# Altium project PCB-Relay-Board-V1.PrjPcb (part 3 of 3)

## Sheet X7A15T-Fabric.SchDoc: PCB-Relay-Board X7A15T-Fabric
size A3; Organization: Test Engineering; Address1: Hans-Bunte-Strasse 19; Address2: D-79108 Freiburg; Address3: Germany; DocumentNumber: U33111; Revision: V1.0; SheetNumber: 4; SheetTotal: 7; Date: JUN 2020; CheckedBy: Moerz, Hoeren; Author: Rudziński; CompanyName: TDK-Micronas GmbH; DrawnBy: Rudziński; Engineer: Rudziński; DateDraw: JUN 2020; DateChecked: 2020-06-19; PageSetup: Record=PageOptions|CenterHorizontal=True|CenterVertical=True|PrintScale=0.97|XCorrection=1.00|YCorrection=1.00|PrintKind=0|BorderSize=5000000|LeftOffset=0|BottomOffset=0|Orientation=2|PaperLength=1000|PaperWidth=1000|Scale=100|PaperSource=7|PrintQuality=-3|MediaType=1|DitherType=10|PrintScaleMode=1|PaperKind=A4|PaperIndex=9; TitleTyp: Title-Typ; Block: CPU & SCT8; Workspace: Workspace
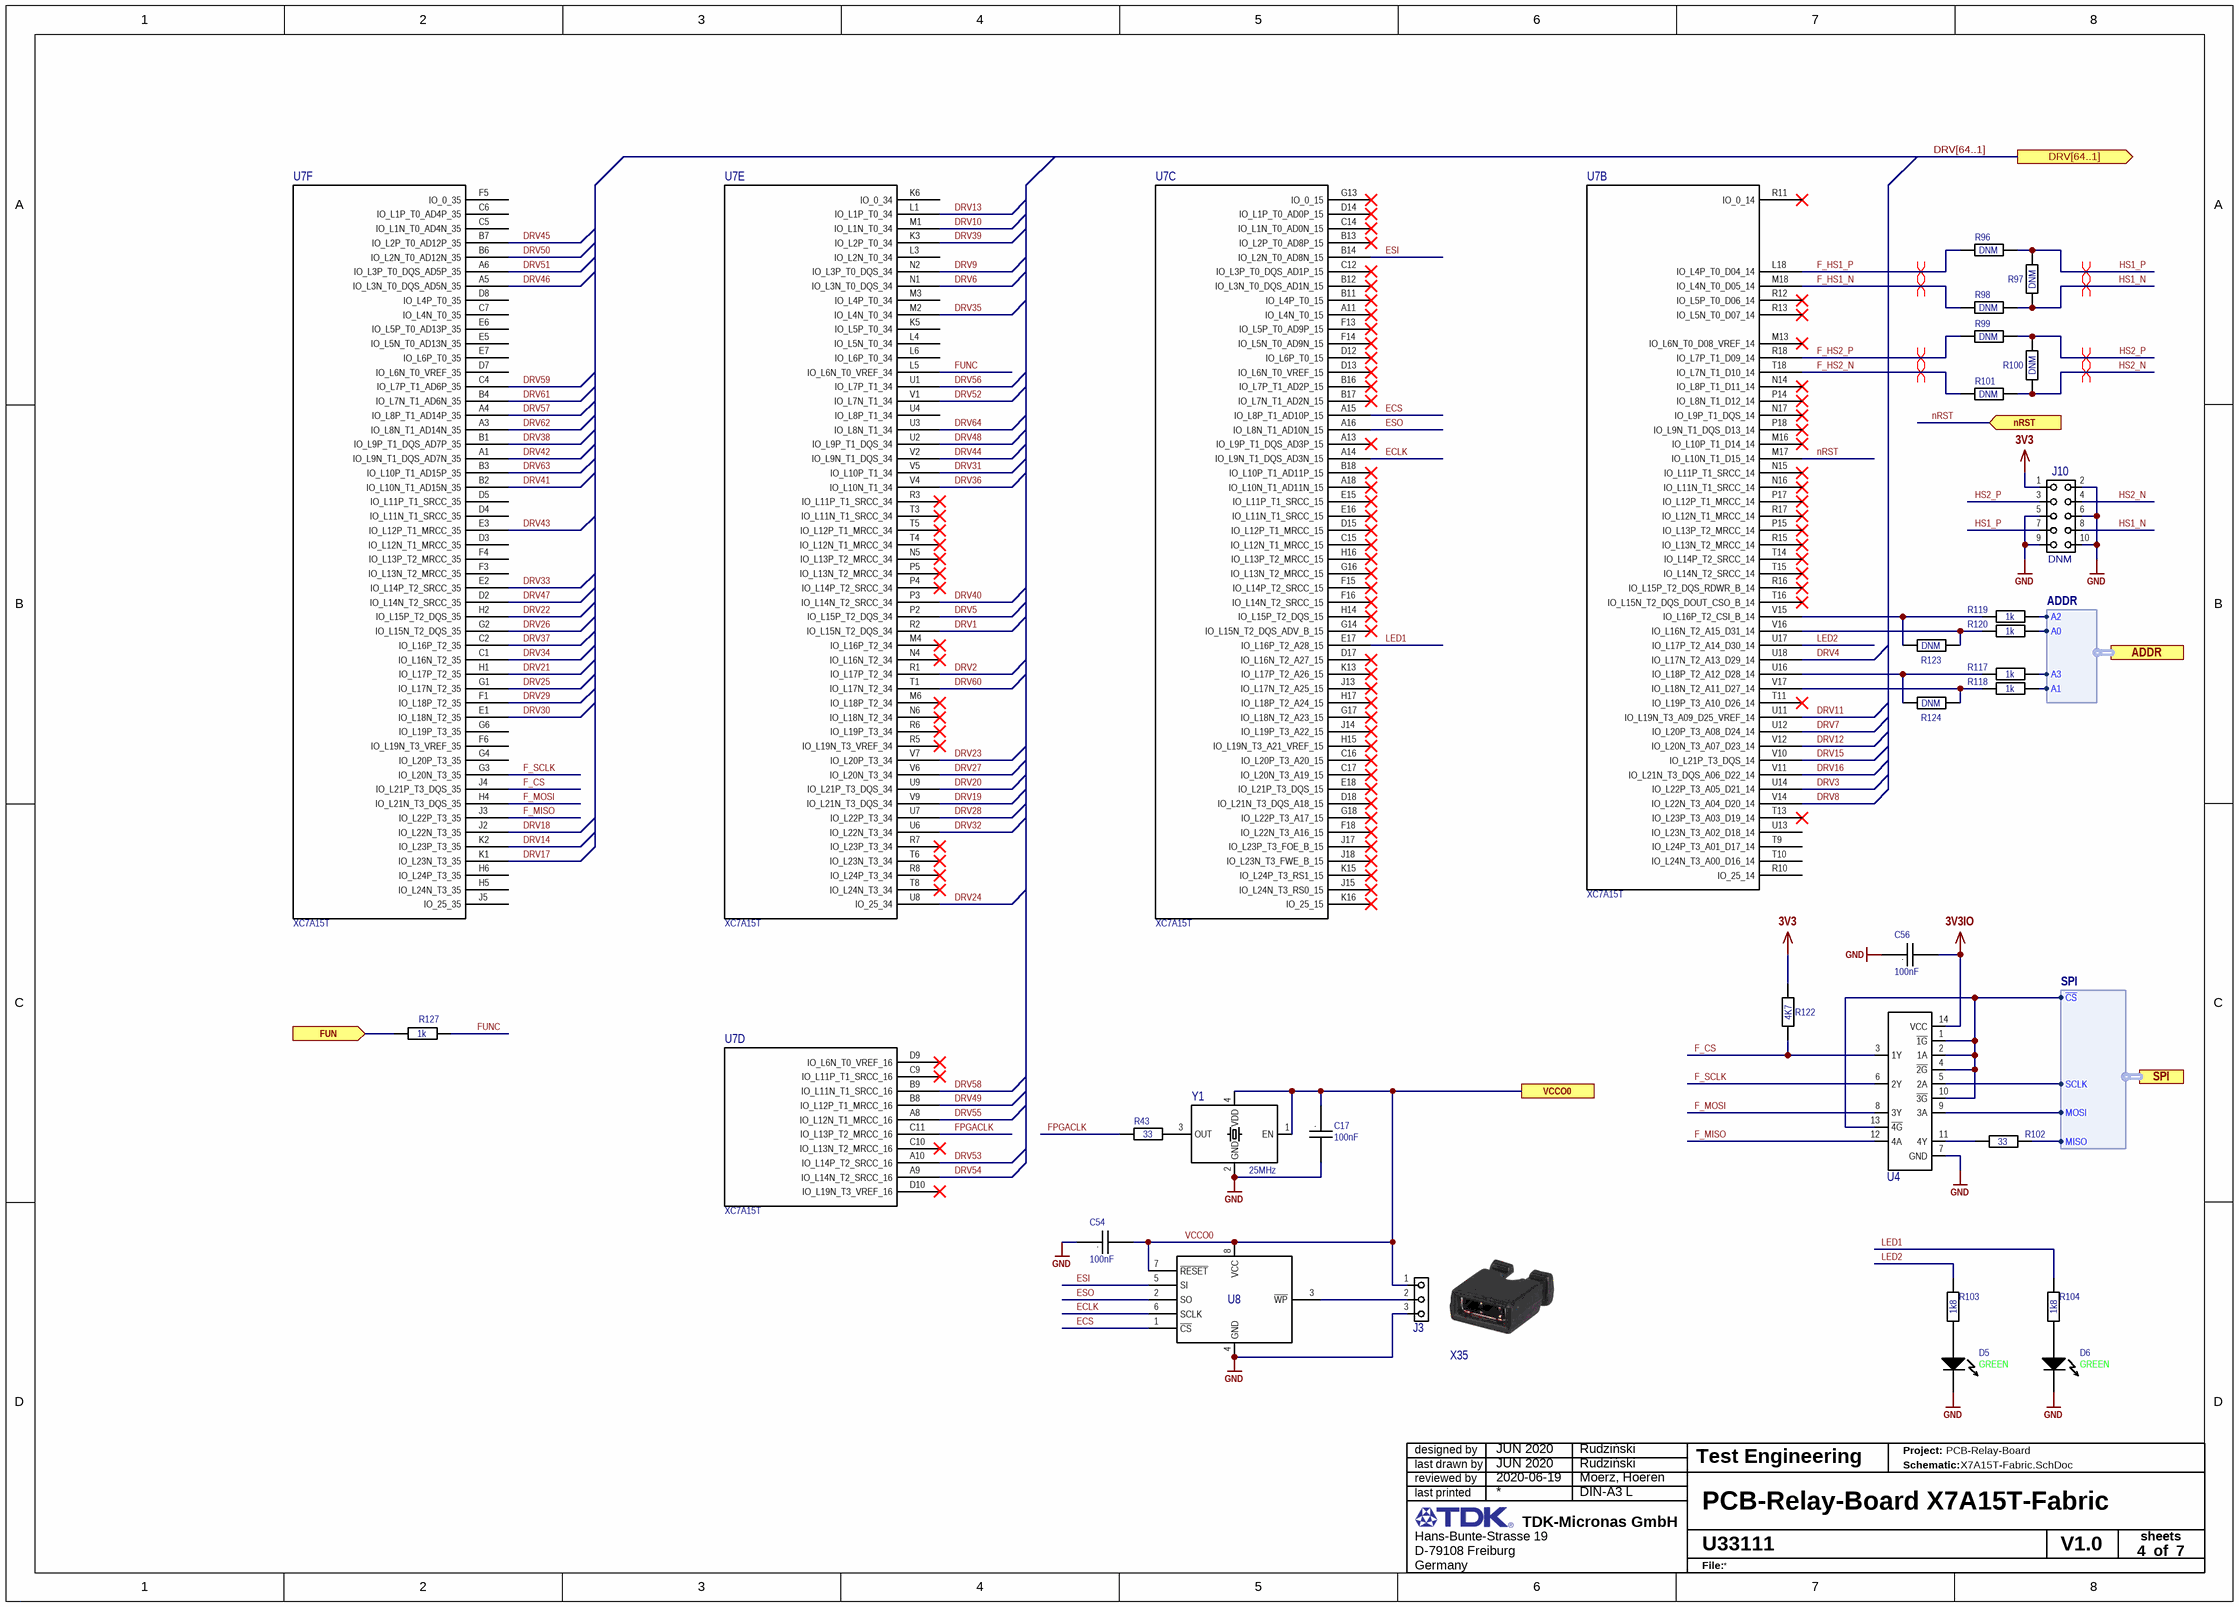
[diagram p4: X7A15T-Fabric.SchDoc]

### Parts
C17  value 100nF  [C0402 Reflow]  (hidden comment: C)
C54  value 100nF  [C0402 Reflow]  (hidden comment: C)
C56  value 100nF  [C0402 Reflow]  (hidden comment: C)
D5  Color: GREEN  [L0603G]  (hidden comment: D)
D6  Color: GREEN  [L0603G]  (hidden comment: D)
J3  J  [Header 100mil 3x1]  (value not drawn)
J10  NicName: DNM  [Header 100mil 5x2]  (hidden comment: J)  (no BOM)
R43  value 33  [R0402 Reflow]  (hidden comment: R)
R96  value DNM  [R0402 Reflow]  (hidden comment: R)  (no BOM)
R97  value DNM  [R0402 Reflow]  (hidden comment: R)  (no BOM)
R98  value DNM  [R0402 Reflow]  (hidden comment: R)  (no BOM)
R99  value DNM  [R0402 Reflow]  (hidden comment: R)  (no BOM)
R100  value DNM  [R0402 Reflow]  (hidden comment: R)  (no BOM)
R101  value DNM  [R0402 Reflow]  (hidden comment: R)  (no BOM)
R102  value 33  [R0402 Reflow]  (hidden comment: R)
R103  value 1k8  [R0603 Reflow]  (hidden comment: R)
R104  value 1k8  [R0603 Reflow]  (hidden comment: R)
R117  value 1k  [R0402 Reflow]  (hidden comment: R)
R118  value 1k  [R0402 Reflow]  (hidden comment: R)
R119  value 1k  [R0402 Reflow]  (hidden comment: R)
R120  value 1k  [R0402 Reflow]  (hidden comment: R)
R122  value 4K7  [R0402 Reflow]  (hidden comment: R)
R123  value DNM  [R0402 Reflow]  (hidden comment: R)  (no BOM)
R124  value DNM  [R0402 Reflow]  (hidden comment: R)  (no BOM)
R127  value 1k  [R0402 Reflow]  (hidden comment: R)
U4  U  [TSSOP14]  (value not drawn)
U7  NicName: XC7A15T  [XC7A15T-1CSG324C]  (hidden comment: U)  (parts B,C,D,E,F of 8)
U8  U  [SOIC8 (R-8)]  (value not drawn)
X35  X  (value not drawn)
Y1  Frequency: 25MHz  [4SMD]  (hidden comment: Y)

### Ports
ADDR (harness ADDR), DRV[64..1] (out), FUN (in), nRST (in), SPI (harness SPI), VCCO0

### Harnesses
SPI: MISO, MOSI, SCLK, ~{CS}
ADDR: A3, A2, A1, A0

### Nets
3V3: C17.1 C54.2 J3.1 J10.1 R122.2 U8.7(~{RESET}) U8.8(VCC) Y1.1(EN) Y1.4(VDD) ; port VCCO0  [also labelled VCCO0]
3V3IO: C56.2 U4.14(VCC)
GND: C17.2 C54.1 C56.1 D5.2(Cathode) D6.2(Cathode) J3.3 J10.2 J10.5 J10.6 J10.9 J10.10 U4.7(GND) U8.4(GND) Y1.2(GND)
~{CS}: U4.1(~{1G}) U4.2(1A) U4.4(~{2G}) U4.10(~{3G}) U4.13(~{4G}) ; port SPI.~{CS}
A0: R120.2 ; port ADDR.A0
A1: R118.2 ; port ADDR.A1
A2: R119.2 ; port ADDR.A2
A3: R117.2 ; port ADDR.A3
DRV1: U7.R2(IO_L15N_T2_DQS_34)
DRV2: U7.R1(IO_L17P_T2_34)
DRV3: U7.U14(IO_L22P_T3_A05_D21_14)
DRV4: U7.U18(IO_L17N_T2_A13_D29_14)
DRV5: U7.P2(IO_L15P_T2_DQS_34)
DRV6: U7.N1(IO_L3N_T0_DQS_34)
DRV7: U7.U12(IO_L20P_T3_A08_D24_14)
DRV8: U7.V14(IO_L22N_T3_A04_D20_14)
DRV9: U7.N2(IO_L3P_T0_DQS_34)
DRV10: U7.M1(IO_L1N_T0_34)
DRV11: U7.U11(IO_L19N_T3_A09_D25_VREF_14)
DRV12: U7.V12(IO_L20N_T3_A07_D23_14)
DRV13: U7.L1(IO_L1P_T0_34)
DRV14: U7.K2(IO_L23P_T3_35)
DRV15: U7.V10(IO_L21P_T3_DQS_14)
DRV16: U7.V11(IO_L21N_T3_DQS_A06_D22_14)
DRV17: U7.K1(IO_L23N_T3_35)
DRV18: U7.J2(IO_L22N_T3_35)
DRV19: U7.V9(IO_L21N_T3_DQS_34)
DRV20: U7.U9(IO_L21P_T3_DQS_34)
DRV21: U7.H1(IO_L17P_T2_35)
DRV22: U7.H2(IO_L15P_T2_DQS_35)
DRV23: U7.V7(IO_L20P_T3_34)
DRV24: U7.U8(IO_25_34)
DRV25: U7.G1(IO_L17N_T2_35)
DRV26: U7.G2(IO_L15N_T2_DQS_35)
DRV27: U7.V6(IO_L20N_T3_34)
DRV28: U7.U7(IO_L22P_T3_34)
DRV29: U7.F1(IO_L18P_T2_35)
DRV30: U7.E1(IO_L18N_T2_35)
DRV31: U7.V5(IO_L10P_T1_34)
DRV32: U7.U6(IO_L22N_T3_34)
DRV33: U7.E2(IO_L14P_T2_SRCC_35)
DRV34: U7.C1(IO_L16N_T2_35)
DRV35: U7.M2(IO_L4N_T0_34)
DRV36: U7.V4(IO_L10N_T1_34)
DRV37: U7.C2(IO_L16P_T2_35)
DRV38: U7.B1(IO_L9P_T1_DQS_AD7P_35)
DRV39: U7.K3(IO_L2P_T0_34)
DRV40: U7.P3(IO_L14N_T2_SRCC_34)
DRV41: U7.B2(IO_L10N_T1_AD15N_35)
DRV42: U7.A1(IO_L9N_T1_DQS_AD7N_35)
DRV43: U7.E3(IO_L12P_T1_MRCC_35)
DRV44: U7.V2(IO_L9N_T1_DQS_34)
DRV45: U7.B7(IO_L2P_T0_AD12P_35)
DRV46: U7.A5(IO_L3N_T0_DQS_AD5N_35)
DRV47: U7.D2(IO_L14N_T2_SRCC_35)
DRV48: U7.U2(IO_L9P_T1_DQS_34)
DRV49: U7.B8(IO_L12P_T1_MRCC_16)
DRV50: U7.B6(IO_L2N_T0_AD12N_35)
DRV51: U7.A6(IO_L3P_T0_DQS_AD5P_35)
DRV52: U7.V1(IO_L7N_T1_34)
DRV53: U7.A10(IO_L14P_T2_SRCC_16)
DRV54: U7.A9(IO_L14N_T2_SRCC_16)
DRV55: U7.A8(IO_L12N_T1_MRCC_16)
DRV56: U7.U1(IO_L7P_T1_34)
DRV57: U7.A4(IO_L8P_T1_AD14P_35)
DRV58: U7.B9(IO_L11N_T1_SRCC_16)
DRV59: U7.C4(IO_L7P_T1_AD6P_35)
DRV60: U7.T1(IO_L17N_T2_34)
DRV61: U7.B4(IO_L7N_T1_AD6N_35)
DRV62: U7.A3(IO_L8N_T1_AD14N_35)
DRV63: U7.B3(IO_L10P_T1_AD15P_35)
DRV64: U7.U3(IO_L8N_T1_34)
ECLK: U7.A14(IO_L9N_T1_DQS_AD3N_15) U8.6(SCLK)  [project net ECLK_4]
ECS: U7.A15(IO_L8P_T1_AD10P_15) U8.1(~{CS})  [project net ECS_4]
ESI: U7.B14(IO_L2N_T0_AD8N_15) U8.5(SI)  [project net ESI_4]
ESO: U7.A16(IO_L8N_T1_AD10N_15) U8.2(SO)  [project net ESO_4]
F_CS: R122.1 U4.3(1Y) U7.J4(IO_L21P_T3_DQS_35)  [project net F_CS_4]
F_HS1_N: R98.1 U7.M18(IO_L4N_T0_D05_14)  [project net F_HS1_N_4]
F_HS1_P: R96.1 U7.L18(IO_L4P_T0_D04_14)  [project net F_HS1_P_4]
F_HS2_N: R101.1 U7.T18(IO_L7N_T1_D10_14)  [project net F_HS2_N_4]
F_HS2_P: R99.1 U7.R18(IO_L7P_T1_D09_14)  [project net F_HS2_P_4]
F_MISO: U4.12(4A) U7.J3(IO_L22P_T3_35)  [project net F_MISO_4]
F_MOSI: U4.8(3Y) U7.H4(IO_L21N_T3_DQS_35)  [project net F_MOSI_4]
F_SCLK: U4.6(2Y) U7.G3(IO_L20N_T3_35)  [project net F_SCLK_4]
FPGACLK: R43.2 U7.C11(IO_L13P_T2_MRCC_16)  [project net FPGACLK_4]
FUN: R127.1 ; port FUN
FUNC: R127.2 U7.L5(IO_L6N_T0_VREF_34)  [project net FUNC_4]
HS1_N: J10.8 R97.1 R98.2  [project net HS1_N_4]
HS1_P: J10.7 R96.2 R97.2  [project net HS1_P_4]
HS2_N: J10.4 R100.1 R101.2  [project net HS2_N_4]
HS2_P: J10.3 R99.2 R100.2  [project net HS2_P_4]
LED1: R104.2 U7.E17(IO_L16P_T2_A28_15)  [project net LED1_4]
LED2: R103.2 U7.U17(IO_L17P_T2_A14_D30_14)  [project net LED2_4]
MISO: R102.1 ; port SPI.MISO
MOSI: U4.9(3A) ; port SPI.MOSI
nRST: U7.M17(IO_L10N_T1_D15_14) ; port nRST
SCLK: U4.5(2A) ; port SPI.SCLK
NetD5_1: D5.1(Anode) R103.1
NetD6_1: D6.1(Anode) R104.1
NetJ3_2: J3.2 U8.3(~{WP})
NetR43_1: R43.1 Y1.3(OUT)
NetR102_2: R102.2 U4.11(4Y)
NetR117_1: R117.1 R124.1 U7.U16(IO_L18P_T2_A12_D28_14)
NetR118_1: R118.1 R124.2 U7.V17(IO_L18N_T2_A11_D27_14)
NetR119_1: R119.1 R123.1 U7.V15(IO_L16P_T2_CSI_B_14)
NetR120_1: R120.1 R123.2 U7.V16(IO_L16N_T2_A15_D31_14)

Not connected (* = marked no-connect by the designer): U7 A11(IO_L4N_T0_15)* A13(IO_L9P_T1_DQS_AD3P_15)* A18(IO_L10N_T1_AD11N_15)* B11(IO_L4P_T0_15)* B12(IO_L3N_T0_DQS_AD1N_15)* B13(IO_L2P_T0_AD8P_15)* B16(IO_L7P_T1_AD2P_15)* B17(IO_L7N_T1_AD2N_15)* B18(IO_L10P_T1_AD11P_15)* C5(IO_L1N_T0_AD4N_35) C6(IO_L1P_T0_AD4P_35) C7(IO_L4N_T0_35) C9(IO_L11P_T1_SRCC_16)* C10(IO_L13N_T2_MRCC_16)* C12(IO_L3P_T0_DQS_AD1P_15)* C14(IO_L1N_T0_AD0N_15)* C15(IO_L12N_T1_MRCC_15)* C16(IO_L20P_T3_A20_15)* C17(IO_L20N_T3_A19_15)* D3(IO_L12N_T1_MRCC_35) D4(IO_L11N_T1_SRCC_35) D5(IO_L11P_T1_SRCC_35) D7(IO_L6N_T0_VREF_35) D8(IO_L4P_T0_35) D9(IO_L6N_T0_VREF_16)* D10(IO_L19N_T3_VREF_16)* D12(IO_L6P_T0_15)* D13(IO_L6N_T0_VREF_15)* D14(IO_L1P_T0_AD0P_15)* D15(IO_L12P_T1_MRCC_15)* D17(IO_L16N_T2_A27_15)* D18(IO_L21N_T3_DQS_A18_15)* E5(IO_L5N_T0_AD13N_35) E6(IO_L5P_T0_AD13P_35) E7(IO_L6P_T0_35) E15(IO_L11P_T1_SRCC_15)* E16(IO_L11N_T1_SRCC_15)* E18(IO_L21P_T3_DQS_15)* F3(IO_L13N_T2_MRCC_35) F4(IO_L13P_T2_MRCC_35) F5(IO_0_35) F6(IO_L19N_T3_VREF_35) F13(IO_L5P_T0_AD9P_15)* F14(IO_L5N_T0_AD9N_15)* F15(IO_L14P_T2_SRCC_15)* F16(IO_L14N_T2_SRCC_15)* F18(IO_L22N_T3_A16_15)* G4(IO_L20P_T3_35) G6(IO_L19P_T3_35) G13(IO_0_15)* G14(IO_L15N_T2_DQS_ADV_B_15)* G16(IO_L13N_T2_MRCC_15)* G17(IO_L18N_T2_A23_15)* G18(IO_L22P_T3_A17_15)* H5(IO_L24N_T3_35) H6(IO_L24P_T3_35) H14(IO_L15P_T2_DQS_15)* H15(IO_L19N_T3_A21_VREF_15)* H16(IO_L13P_T2_MRCC_15)* H17(IO_L18P_T2_A24_15)* J5(IO_25_35) J13(IO_L17N_T2_A25_15)* J14(IO_L19P_T3_A22_15)* J15(IO_L24N_T3_RS0_15)* J17(IO_L23P_T3_FOE_B_15)* J18(IO_L23N_T3_FWE_B_15)* K5(IO_L5P_T0_34) K6(IO_0_34) K13(IO_L17P_T2_A26_15)* K15(IO_L24P_T3_RS1_15)* K16(IO_25_15)* L3(IO_L2N_T0_34) L4(IO_L5N_T0_34) L6(IO_L6P_T0_34) M3(IO_L4P_T0_34) M4(IO_L16P_T2_34)* M6(IO_L18P_T2_34)* M13(IO_L6N_T0_D08_VREF_14)* M16(IO_L10P_T1_D14_14)* N4(IO_L16N_T2_34)* N5(IO_L13P_T2_MRCC_34)* N6(IO_L18N_T2_34)* N14(IO_L8P_T1_D11_14)* N15(IO_L11P_T1_SRCC_14)* N16(IO_L11N_T1_SRCC_14)* N17(IO_L9P_T1_DQS_14)* P4(IO_L14P_T2_SRCC_34)* P5(IO_L13N_T2_MRCC_34)* P14(IO_L8N_T1_D12_14)* P15(IO_L13P_T2_MRCC_14)* P17(IO_L12P_T1_MRCC_14)* P18(IO_L9N_T1_DQS_D13_14)* R3(IO_L11P_T1_SRCC_34)* R5(IO_L19N_T3_VREF_34)* R6(IO_L19P_T3_34)* R7(IO_L23P_T3_34)* R8(IO_L24P_T3_34)* R10(IO_25_14) R11(IO_0_14)* R12(IO_L5P_T0_D06_14)* R13(IO_L5N_T0_D07_14)* R15(IO_L13N_T2_MRCC_14)* R16(IO_L15P_T2_DQS_RDWR_B_14)* R17(IO_L12N_T1_MRCC_14)* T3(IO_L11N_T1_SRCC_34)* T4(IO_L12N_T1_MRCC_34)* T5(IO_L12P_T1_MRCC_34)* T6(IO_L23N_T3_34)* T8(IO_L24N_T3_34)* T9(IO_L24P_T3_A01_D17_14) T10(IO_L24N_T3_A00_D16_14) T11(IO_L19P_T3_A10_D26_14)* T13(IO_L23P_T3_A03_D19_14)* T14(IO_L14P_T2_SRCC_14)* T15(IO_L14N_T2_SRCC_14)* T16(IO_L15N_T2_DQS_DOUT_CSO_B_14)* U4(IO_L8P_T1_34) U13(IO_L23N_T3_A02_D18_14)

### Buses and harness runs
bus DRV[64..1] = port DRV[64..1]

### Layout directives
differential pair; net class GENHS_DP: F_HS1_N_4, F_HS1_P_4, F_HS2_N_4, F_HS2_P_4, HS1_N_4, HS1_P_4, HS2_N_4, HS2_P_4

### Notes on the sheet
- designed by
- reviewed by
- last drawn by
- Project:
- Schematic:
- last printed
- DIN-A3 L
- sheets
- of
- File:
- (in symbol C) .

### Library data of the parts
C17 C54 C56 = C: CAP CER 0.1UF 25V X7R 0402; 04. Manufacturer: Yageo; 07. Manufacturer  Part Number: CC0402KRX7R8BB104; Tolerance: ±5%; Voltage Rating: 16V; 03. Unit Price: 0.09; 13. Created Date/Name: AUG2018/Hören; Type: X7R; ComponentLink1Description: Info; ComponentLink1URL: https://www.digikey.de/product-detail/en/kemet/C0402C104J4RACTU/399-7761-6-ND/3472292; 02. Distributor Part Number: 311-2077-6-ND; 09. Operating Temperature: -55°C ~ 125°C; 11. RoHS: YES; 01. Distributor: DigiKey; ComponentLink2Description: DataSheet; ComponentLink2URL: https://content.kemet.com/datasheets/KEM_C1002_X7R_SMD.pdf; Package: 0402
D5 D6 = LED: LED GREEN DIFFUSED 0603 SMD; 04. Manufacturer: OSRAM Opto Semiconductors Inc.; 07. Manufacturer  Part Number: LG L29K-G2J1-24-Z; Vf: 1.7V; If: 2mA; Wave Length: 570nm; Viewing Angle: 160°; 03. Unit Price: 0.4; 13. Created Date/Name: AUG2018/Hören; ComponentLink1Description: Info; ComponentLink1URL: https://www.digikey.de/products/en?keywords=475-2709-6-ND; ComponentLink2Description: DataSheet; ComponentLink2URL: https://www.digikey.de/products/en?keywords=475-2709-6-ND; 02. Distributor Part Number: 475-2709-6-ND; 11. RoHS: YES; 01. Distributor: DigiKey
J3 = Header 3Pins 100mil: CONN HEADER VERT 3POS 2.54MM; 04. Manufacturer: Samtec Inc.; 07. Manufacturer  Part Number: HMTSW-103-07-G-S-240; 03. Unit Price: 0.25; 13. Created Date/Name: AUG2018/Hören; 01. Distributor: Samtec Inc.; 02. Distributor Part Number: HMTSW-103-07-G-S-240; 11. RoHS: YES; ComponentLink1Description: Info; ComponentLink1URL: https://www.samtec.com/products/hmtsw-103-07-g-s-240; ComponentLink2Description: DataSheet; ComponentLink2URL: http://suddendocs.samtec.com/catalog_english/hmtsw.pdf
J10 = Header 5x2Pins 100mil: 04. Manufacturer: Samtec Inc.; 07. Manufacturer  Part Number: HMTSW-103-07-G-S-240; 03. Unit Price: 0.25; 13. Created Date/Name: AUG2018/Hören; 01. Distributor: Samtec Inc.; 02. Distributor Part Number: HMTSW-103-07-G-S-240; 11. RoHS: YES; ComponentLink1Description: Info; ComponentLink1URL: https://www.samtec.com/products/hmtsw-103-07-g-s-240; ComponentLink2Description: DataSheet; ComponentLink2URL: http://suddendocs.samtec.com/catalog_english/hmtsw.pdf
R43 R102 = R: RES SMD 33 OHM 1% 1/16W 0402; 04. Manufacturer: Yageo; 07. Manufacturer  Part Number: RC0402FR-0733RL; 03. Unit Price: 0.09; 13. Created Date/Name: AUG2018/Hören; Power Rating: 63mW; Tolerance: ±1%; ComponentLink1URL: https://www.digikey.de/products/en?keywords=311-33.0LRDKR-ND; ComponentLink1Description: Info; 02. Distributor Part Number: 311-33.0LRDKR-ND; 09. Operating Temperature: -55°C ~ 155°C; 11. RoHS: YES; 01. Distributor: DigiKey; ComponentLink2Description: DataSheet; Type: Thick Film; Package: 0402
R96-R101 = R_19: RES SMD 33 OHM 1% 1/16W 0402; 04. Manufacturer: Yageo; 07. Manufacturer  Part Number: RC0402FR-0733RL; 03. Unit Price: 0.09; 13. Created Date/Name: AUG2018/Hören; Power Rating: 63mW; Tolerance: ±1%; ComponentLink1URL: https://www.digikey.de/products/en?keywords=311-33.0LRDKR-ND; ComponentLink1Description: Info; 02. Distributor Part Number: 311-33.0LRDKR-ND; 09. Operating Temperature: -55°C ~ 155°C; 11. RoHS: YES; 01. Distributor: DigiKey; ComponentLink2Description: DataSheet; Type: Thick Film; Package: 0402
R103 R104 = R: RES SMD 1.8K OHM 1% 1/16W 0402; 04. Manufacturer: Yageo; 07. Manufacturer  Part Number: RC0402FR-071K8L; 03. Unit Price: 0.09; 13. Created Date/Name: AUG2018/Hören; Power Rating: 63mW; Tolerance: ±1%; ComponentLink1URL: https://www.digikey.de/product-detail/en/yageo/RC0402FR-071K65L/YAG3043DKR-ND/5282914; ComponentLink1Description: Info; 02. Distributor Part Number: 311-1.80KLRCT-ND; 09. Operating Temperature: -55°C ~ 155°C; 11. RoHS: YES; 01. Distributor: DigiKey; ComponentLink2Description: DataSheet; Type: Thick Film; Package: 0402
R117-R120 R127 = R: RES SMD 1K OHM 1% 1/16W 0402; 04. Manufacturer: Yageo; 07. Manufacturer  Part Number: RC0402FR-071KP; 03. Unit Price: 0.09; 13. Created Date/Name: AUG2018/Hören; Tolerance: ±1%; ComponentLink1URL: *; ComponentLink1Description: Info; 02. Distributor Part Number: YAG1254CT-ND; 09. Operating Temperature: -xx..+yy°C; 11. RoHS: ???; 01. Distributor: DigiKey; ComponentLink2Description: DataSheet; Package: *
R122-R124 = R: RES SMD 4.7K OHM 1% 1/16W 0402; 04. Manufacturer: Yageo; 07. Manufacturer  Part Number: RC0402FR-074K7L; 03. Unit Price: 0.09; 13. Created Date/Name: AUG2018/Hören; Power Rating: 63mW; Tolerance: ±1%; ComponentLink1URL: https://www.digikey.de/products/en?keywords=311-4.7KLRDKR-ND; ComponentLink1Description: Info; 02. Distributor Part Number: 311-4.7KLRDKR-ND; 09. Operating Temperature: -55°C ~ 155°C; 11. RoHS: YES; 01. Distributor: DigiKey; ComponentLink2Description: DataSheet; Type: Thick Film; Package: 0402
U4 = 74LCX125: IC BUF NON-INVERT 3.6V 14TSSOP; 04. Manufacturer: STMicroelectronics; 07. Manufacturer  Part Number: 74LCX125YTTR; 03. Unit Price: 0.51; 01. Distributor: DigiKey; 02. Distributor Part Number: 497-13204-2-ND; 11. RoHS: YES; ComponentLink1Description: Info; ComponentLink2Description: DataSheet; Package: TSSOP14
U7 = XC7A15T-CS324: XC7A15T-1CSG324C; MFR: XILINX; POPULATED: yes; 03. Unit Price: 20.65; MFR-PN: XC7A15T-CS324; 04. Manufacturer: XILINX; 07. Manufacturer  Part Number: XC7A15T-1CSG324C; 01. Distributor: Avnet; 02. Distributor Part Number: XC7A15T-1CSG324C; 09. Operating Temperature: 0°C ~ 85°C (TJ); 11. RoHS: YES; ComponentLink4Description: Info; ComponentLink4URL: https://www.digikey.de/products/en?keywords=XC7A15T-1CSG324C; ComponentLink5Description: DataSheet; ComponentLink5URL: https://www.xilinx.com/support/documentation/data_sheets/ds181_Artix_7_Data_Sheet.pdf; ComponentLink6Description: NXP; ComponentLink6URL: https://www.nxp.com/part/MK20DN512VMD10
U8 = MX25R3235FM1IH0: IC FLASH 32M SPI 80MHZ 8SOP; 04. Manufacturer: Macronix; 03. Unit Price: 0.79; 13. Created Date/Name: AUG 2018 / Hören; 01. Distributor: DigiKey; 02. Distributor Part Number: 1092-1175-ND; 07. Manufacturer  Part Number: MX25R3235FM1IH0; ComponentLink1Description: Info; ComponentLink1URL: https://www.digikey.de/product-detail/en/macronix/MX25R3235FM1IH0/1092-1175-ND/5957736; ComponentLink2Description: DataSheet; ComponentLink2URL: https://www.macronix.com/Lists/Datasheet/Attachments/7534/MX25R3235F%2c%20Wide%20Range%2c%2032Mb%2c%20v1.6.pdf
X35 = Jumper: CONN JUMPER SHORTING .100" GOLD; 04. Manufacturer: Sullins Connector Solutions; 07. Manufacturer  Part Number: QPC02SXGN-RC; 03. Unit Price: 0.09; 13. Created Date/Name: AUG2018/Hören; 01. Distributor: DigiKey; 02. Distributor Part Number: S9337-ND; 09. Operating Temperature: -xx..+yy°C; 11. RoHS: ???; ComponentLink1Description: Info; ComponentLink1URL: https://www.digikey.de/product-detail/en/sullins-connector-solutions/QPC02SXGN-RC/S9337-ND/2618262; ComponentLink2Description: DataSheet
Y1 = ASE-25.000MHZ-LC-T: XTAL OSC XO 25.0000MHZ CMOS SMD; 04. Manufacturer: Abracon LLC; 03. Unit Price: 1.46; 13. Created Date/Name: AUG 2018 / Hören; 01. Distributor: DigiKey; 02. Distributor Part Number: 535-9568-1-ND; 07. Manufacturer  Part Number: ASE-25.000MHZ-LC-T; 11. RoHS: YES; ComponentLink1Description: Info; ComponentLink1URL: https://www.digikey.de/products/en?keywords=535-9568-1-ND; ComponentLink2Description: DataSheet; Package: 4SMD

## Sheet X7A15T-Power.SchDoc: PCB-Relay-Board X7A15T-Power
size A4 portrait; Organization: Test Engineering; Address1: Hans-Bunte-Strasse 19; Address2: D-79108 Freiburg; Address3: Germany; DocumentNumber: U33111; Revision: V1.0; SheetNumber: 5; SheetTotal: 7; Date: JUN 2020; CheckedBy: Moerz, Hoeren; Author: Rudziński; CompanyName: TDK-Micronas GmbH; DrawnBy: Rudziński; Engineer: Rudziński; DateDraw: JUN 2020; DateChecked: 2020-06-19; PageSetup: Record=PageOptions|CenterHorizontal=True|CenterVertical=True|PrintScale=0.97|XCorrection=1.00|YCorrection=1.00|PrintKind=0|BorderSize=5000000|LeftOffset=0|BottomOffset=0|Orientation=2|PaperLength=1000|PaperWidth=1000|Scale=100|PaperSource=7|PrintQuality=-3|MediaType=1|DitherType=10|PrintScaleMode=1|PaperKind=A4|PaperIndex=9; TitleTyp: Title-Typ; Block: CPU & SCT8; Workspace: Workspace
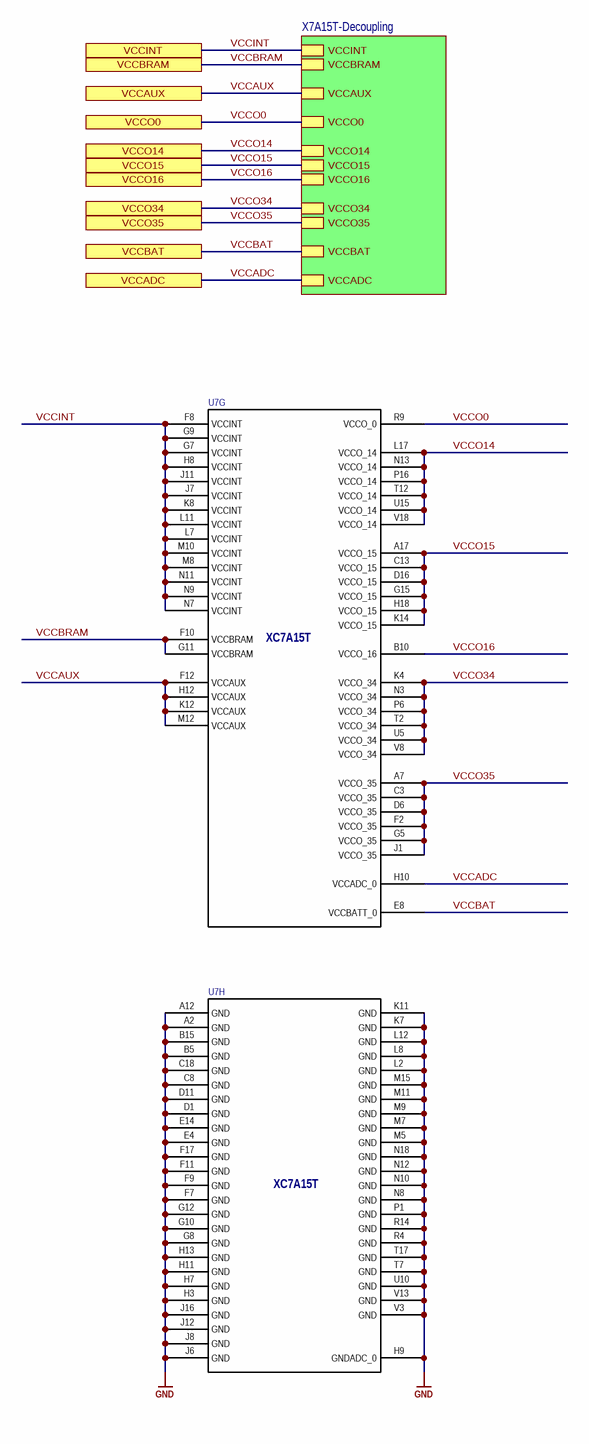
[diagram p5: X7A15T-Power.SchDoc]

### Parts
U7  NicName: XC7A15T  [XC7A15T-1CSG324C]  (hidden comment: U)  (parts G,H of 8)

### Sub-sheets
X7A15T-Decoupling = X7A15T-Decoupling.SchDoc: VCCBRAM, VCCAUX, VCCINT, VCCO34, VCCBAT, VCCO14, VCCO15, VCCO0, VCCADC, VCCO16, VCCO35

### Ports
VCCADC, VCCAUX, VCCBAT, VCCBRAM, VCCINT, VCCO0, VCCO14, VCCO15, VCCO16, VCCO34, VCCO35

### Nets
GND: U7.A2(GND) U7.A12(GND) U7.B5(GND) U7.B15(GND) U7.C8(GND) U7.C18(GND) U7.D1(GND) U7.D11(GND) U7.E4(GND) U7.E8(VCCBATT_0) U7.E14(GND) U7.F7(GND) U7.F9(GND) U7.F11(GND) U7.F17(GND) U7.G8(GND) U7.G10(GND) U7.G12(GND) U7.H3(GND) U7.H7(GND) U7.H9(GNDADC_0) U7.H11(GND) U7.H13(GND) U7.J6(GND) U7.J8(GND) U7.J12(GND) U7.J16(GND) U7.K7(GND) U7.K11(GND) U7.L2(GND) U7.L8(GND) U7.L12(GND) U7.M5(GND) U7.M7(GND) U7.M9(GND) U7.M11(GND) U7.M15(GND) U7.N8(GND) U7.N10(GND) U7.N12(GND) U7.N18(GND) U7.P1(GND) U7.R4(GND) U7.R14(GND) U7.T7(GND) U7.T17(GND) U7.U10(GND) U7.V3(GND) U7.V13(GND) ; port VCCBAT, sheet X7A15T-Decoupling/VCCBAT  [also labelled VCCBAT]
VCCADC: U7.H10(VCCADC_0) ; port VCCADC, sheet X7A15T-Decoupling/VCCADC  [project net 1V8A]
VCCAUX: U7.F12(VCCAUX) U7.H12(VCCAUX) U7.K12(VCCAUX) U7.M12(VCCAUX) ; port VCCAUX, sheet X7A15T-Decoupling/VCCAUX  [project net 1V8]
VCCBRAM: U7.F8(VCCINT) U7.F10(VCCBRAM) U7.G7(VCCINT) U7.G9(VCCINT) U7.G11(VCCBRAM) U7.H8(VCCINT) U7.J7(VCCINT) U7.J11(VCCINT) U7.K8(VCCINT) U7.L7(VCCINT) U7.L11(VCCINT) U7.M8(VCCINT) U7.M10(VCCINT) U7.N7(VCCINT) U7.N9(VCCINT) U7.N11(VCCINT) ; port VCCINT, port VCCBRAM, sheet X7A15T-Decoupling/VCCBRAM, sheet X7A15T-Decoupling/VCCINT  [also labelled VCCINT]  [project net 1V0]
VCCO0: U7.A7(VCCO_35) U7.A17(VCCO_15) U7.B10(VCCO_16) U7.C3(VCCO_35) U7.C13(VCCO_15) U7.D6(VCCO_35) U7.D16(VCCO_15) U7.F2(VCCO_35) U7.G5(VCCO_35) U7.G15(VCCO_15) U7.H18(VCCO_15) U7.J1(VCCO_35) U7.K4(VCCO_34) U7.K14(VCCO_15) U7.L17(VCCO_14) U7.N3(VCCO_34) U7.N13(VCCO_14) U7.P6(VCCO_34) U7.P16(VCCO_14) U7.R9(VCCO_0) U7.T2(VCCO_34) U7.T12(VCCO_14) U7.U5(VCCO_34) U7.U15(VCCO_14) U7.V8(VCCO_34) U7.V18(VCCO_14) ; port VCCO0, port VCCO14, port VCCO15, port VCCO16, port VCCO34, port VCCO35, sheet X7A15T-Decoupling/VCCO34, sheet X7A15T-Decoupling/VCCO14, sheet X7A15T-Decoupling/VCCO15, sheet X7A15T-Decoupling/VCCO0, sheet X7A15T-Decoupling/VCCO16, sheet X7A15T-Decoupling/VCCO35  [also labelled VCCO14, VCCO15, VCCO16, VCCO34, VCCO35]  [project net 3V3]

### Notes on the sheet
- designed by
- reviewed by
- last drawn by
- Project:
- Schematic:
- last printed
- DIN-A4 P
- sheets
- of
- File:

### Library data of the parts
U7 = XC7A15T-CS324: as U7 on sheet X7A15T-Fabric; MFR-PN: XC7A15T-CS324; 04. Manufacturer: XILINX; 07. Manufacturer  Part Number: XC7A15T-1CSG324C; 01. Distributor: Avnet; 02. Distributor Part Number: XC7A15T-1CSG324C; 09. Operating Temperature: 0°C ~ 85°C (TJ); 11. RoHS: YES; ComponentLink4Description: Info; ComponentLink4URL: https://www.digikey.de/products/en?keywords=XC7A15T-1CSG324C; ComponentLink5Description: DataSheet; ComponentLink5URL: https://www.xilinx.com/support/documentation/data_sheets/ds181_Artix_7_Data_Sheet.pdf; ComponentLink6Description: NXP; ComponentLink6URL: https://www.nxp.com/part/MK20DN512VMD10

## Sheet X7A15T-Decoupling.SchDoc: PCB-Relay-Board X7A15T-Decoupling
size A4 portrait; Organization: Test Engineering; Address1: Hans-Bunte-Strasse 19; Address2: D-79108 Freiburg; Address3: Germany; DocumentNumber: U33111; Revision: V1.0; SheetNumber: 6; SheetTotal: 7; Date: JUN 2020; CheckedBy: Moerz, Hoeren; Author: Rudziński; CompanyName: TDK-Micronas GmbH; DrawnBy: Rudziński; Engineer: Rudziński; DateDraw: JUN 2020; DateChecked: 2020-06-19; PageSetup: Record=PageOptions|CenterHorizontal=True|CenterVertical=True|PrintScale=0.97|XCorrection=1.00|YCorrection=1.00|PrintKind=0|BorderSize=5000000|LeftOffset=0|BottomOffset=0|Orientation=2|PaperLength=1000|PaperWidth=1000|Scale=100|PaperSource=7|PrintQuality=-3|MediaType=1|DitherType=10|PrintScaleMode=1|PaperKind=A4|PaperIndex=9; TitleTyp: Title-Typ; Block: CPU & SCT8; Workspace: Workspace
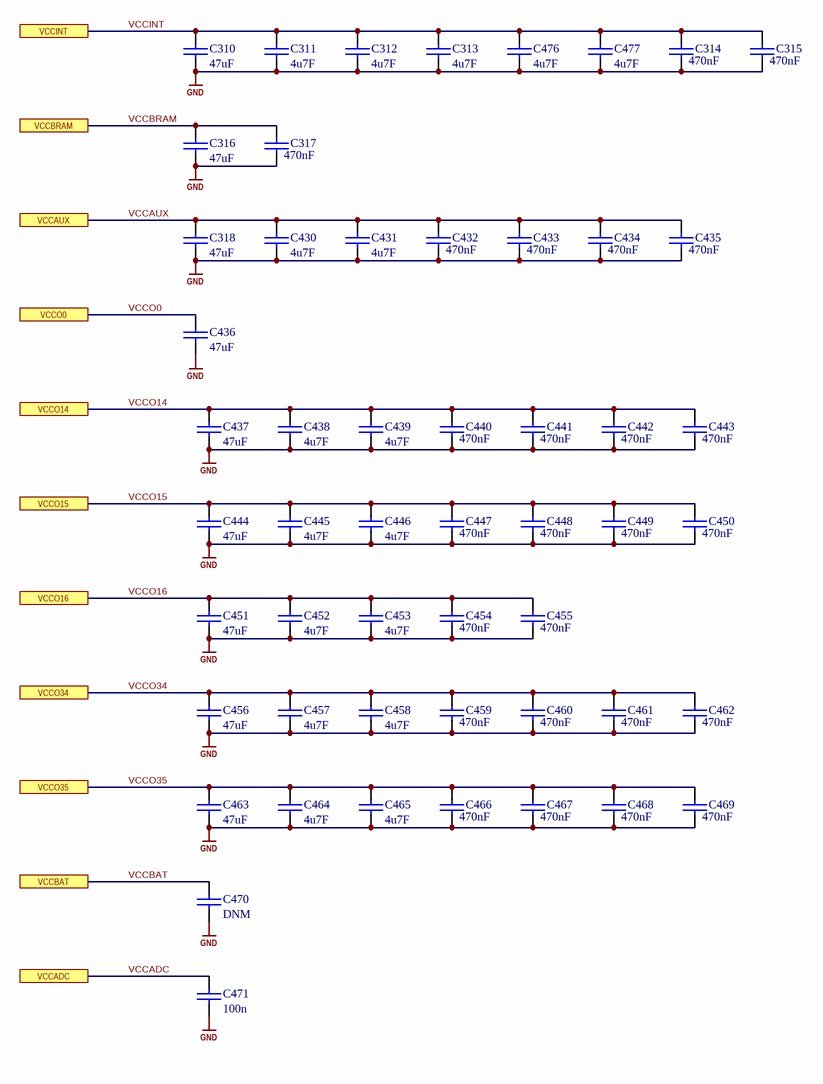
[diagram p6: X7A15T-Decoupling.SchDoc]

### Parts
C310  value 47uF  [C0805 Reflow]  (hidden comment: C)
C311  value 4u7F  [C0402 RevOne]  (hidden comment: C)
C312  value 4u7F  [C0402 RevOne]  (hidden comment: C)
C313  value 4u7F  [C0402 RevOne]  (hidden comment: C)
C314  value 470nF  [C0402 RevOne]  (hidden comment: C)
C315  value 470nF  [C0402 RevOne]  (hidden comment: C)
C316  value 47uF  [C0805 Reflow]  (hidden comment: C)
C317  value 470nF  [C0402 RevOne]  (hidden comment: C)
C318  value 47uF  [C0805 Reflow]  (hidden comment: C)
C430  value 4u7F  [C0402 RevOne]  (hidden comment: C)
C431  value 4u7F  [C0402 RevOne]  (hidden comment: C)
C432  value 470nF  [C0402 RevOne]  (hidden comment: C)
C433  value 470nF  [C0402 RevOne]  (hidden comment: C)
C434  value 470nF  [C0402 RevOne]  (hidden comment: C)
C435  value 470nF  [C0402 RevOne]  (hidden comment: C)
C436  value 47uF  [C0805 Reflow]  (hidden comment: C)
C437  value 47uF  [C0805 Reflow]  (hidden comment: C)
C438  value 4u7F  [C0402 RevOne]  (hidden comment: C)
C439  value 4u7F  [C0402 RevOne]  (hidden comment: C)
C440  value 470nF  [C0402 RevOne]  (hidden comment: C)
C441  value 470nF  [C0402 RevOne]  (hidden comment: C)
C442  value 470nF  [C0402 RevOne]  (hidden comment: C)
C443  value 470nF  [C0402 RevOne]  (hidden comment: C)
C444  value 47uF  [C0805 Reflow]  (hidden comment: C)
C445  value 4u7F  [C0402 RevOne]  (hidden comment: C)
C446  value 4u7F  [C0402 RevOne]  (hidden comment: C)
C447  value 470nF  [C0402 RevOne]  (hidden comment: C)
C448  value 470nF  [C0402 RevOne]  (hidden comment: C)
C449  value 470nF  [C0402 RevOne]  (hidden comment: C)
C450  value 470nF  [C0402 RevOne]  (hidden comment: C)
C451  value 47uF  [C0805 Reflow]  (hidden comment: C)
C452  value 4u7F  [C0402 RevOne]  (hidden comment: C)
C453  value 4u7F  [C0402 RevOne]  (hidden comment: C)
C454  value 470nF  [C0402 RevOne]  (hidden comment: C)
C455  value 470nF  [C0402 RevOne]  (hidden comment: C)
C456  value 47uF  [C0805 Reflow]  (hidden comment: C)
C457  value 4u7F  [C0402 RevOne]  (hidden comment: C)
C458  value 4u7F  [C0402 RevOne]  (hidden comment: C)
C459  value 470nF  [C0402 RevOne]  (hidden comment: C)
C460  value 470nF  [C0402 RevOne]  (hidden comment: C)
C461  value 470nF  [C0402 RevOne]  (hidden comment: C)
C462  value 470nF  [C0402 RevOne]  (hidden comment: C)
C463  value 47uF  [C0805 Reflow]  (hidden comment: C)
C464  value 4u7F  [C0402 RevOne]  (hidden comment: C)
C465  value 4u7F  [C0402 RevOne]  (hidden comment: C)
C466  value 470nF  [C0402 RevOne]  (hidden comment: C)
C467  value 470nF  [C0402 RevOne]  (hidden comment: C)
C468  value 470nF  [C0402 RevOne]  (hidden comment: C)
C469  value 470nF  [C0402 RevOne]  (hidden comment: C)
C470  value DNM  [C0402 RevOne]  (hidden comment: C)  (no BOM)
C471  value 100n  [C0402 RevOne]  (hidden comment: C)
C476  value 4u7F  [C0402 RevOne]  (hidden comment: C)
C477  value 4u7F  [C0402 RevOne]  (hidden comment: C)

### Ports
VCCADC, VCCAUX, VCCBAT, VCCBRAM, VCCINT, VCCO0, VCCO14, VCCO15, VCCO16, VCCO34, VCCO35

### Nets
GND: C310.2 C311.2 C312.2 C313.2 C314.2 C315.2 C316.2 C317.2 C318.2 C430.2 C431.2 C432.2 C433.2 C434.2 C435.2 C436.2 C437.2 C438.2 C439.2 C440.2 C441.2 C442.2 C443.2 C444.2 C445.2 C446.2 C447.2 C448.2 C449.2 C450.2 C451.2 C452.2 C453.2 C454.2 C455.2 C456.2 C457.2 C458.2 C459.2 C460.2 C461.2 C462.2 C463.2 C464.2 C465.2 C466.2 C467.2 C468.2 C469.2 C470.1 C470.2 C471.2 C476.2 C477.2 ; port VCCBAT  [also labelled VCCBAT]
VCCADC: C471.1 ; port VCCADC  [project net 1V8A]
VCCAUX: C318.1 C430.1 C431.1 C432.1 C433.1 C434.1 C435.1 ; port VCCAUX  [project net 1V8]
VCCBRAM: C310.1 C311.1 C312.1 C313.1 C314.1 C315.1 C316.1 C317.1 C476.1 C477.1 ; port VCCBRAM, port VCCINT  [also labelled VCCINT]  [project net 1V0]
VCCO0: C436.1 C437.1 C438.1 C439.1 C440.1 C441.1 C442.1 C443.1 C444.1 C445.1 C446.1 C447.1 C448.1 C449.1 C450.1 C451.1 C452.1 C453.1 C454.1 C455.1 C456.1 C457.1 C458.1 C459.1 C460.1 C461.1 C462.1 C463.1 C464.1 C465.1 C466.1 C467.1 C468.1 C469.1 ; port VCCO34, port VCCO14, port VCCO15, port VCCO0, port VCCO16, port VCCO35  [also labelled VCCO14, VCCO15, VCCO16, VCCO34, VCCO35]  [project net 3V3]

### Notes on the sheet
- designed by
- reviewed by
- last drawn by
- Project:
- Schematic:
- last printed
- DIN-A4 P
- sheets
- of
- File:

### Library data of the parts
C310 C316 C318 C436 C437 C444 C451 C456 C463 = CAP: CAP CER 47UF 10V X5R 0805; MFR-PN: GRM32ER71A476KE15L; MFR: MURATA; MFR-TYPE: GRM series; 04. Manufacturer: Murata Electronics North America; 07. Manufacturer  Part Number: GRM21BR61A476ME15L; POPULATED: yes; Parameters: X7R, 10V, 10%; 03. Unit Price: 0.67; Tolerance: ±20%; Type: X7R; 3D-Export: No; Temperature Range: -55°C ~ 85°C; 01. Distributor: DigiKey; 02. Distributor Part Number: 490-9961-6-ND; 09. Operating Temperature: -55°C ~ 85°C; 11. RoHS: YES; Voltage Rating: 10V; ComponentLink4Description: Info; ComponentLink4URL: https://www.digikey.de/product-detail/en/murata-electronics-north-america/GRM21BR61A476ME15L/490-9961-6-ND/5027050; ComponentLink5Description: DataSheet; ComponentLink5URL: https://search.murata.co.jp/Ceramy/image/img/A01X/G101/ENG/GRM21BR61A476ME15-01.pdf
C311-C313 C430 C431 C438 C439 C445 C446 C452 C453 C457 C458 C464 C465 C470 C471 C476 C477 = CAP: CAP CER 4.7UF 6.3V X5R 0402; 04. Manufacturer: Samsung Electro-Mechanics; 07. Manufacturer  Part Number: CL05A475KQ5NRNC; POPULATED: yes; Parameters: X7R, 6V3, 10%; 03. Unit Price: 0.28; Tolerance: 10%; Type: X7R; Voltage Rating: 6V3; 3D-Export: No; Temperature Range: -40°C/+85°C; 01. Distributor: DigiKey; 02. Distributor Part Number: 1276-1481-6-ND; 09. Operating Temperature: -55°C ~ 85°C; 11. RoHS: YES; ComponentLink4Description: DataSheet; ComponentLink4URL: https://media.digikey.com/pdf/Data%20Sheets/Samsung%20PDFs/CL_Series_MLCC_ds.pdf; ComponentLink5Description: Info; ComponentLink5URL: https://www.digikey.de/product-detail/en/samsung-electro-mechanics/CL05A475KQ5NRNC/1276-1481-6-ND/3891995
C314 C315 C317 C432-C435 C440-C443 C447-C450 C454 C455 C459-C462 C466-C469 = CAP: CAP CER 0.47UF 10V X5R 0402; 04. Manufacturer: Samsung Electro-Mechanics; 07. Manufacturer  Part Number: CL05A474KP5NNNC; POPULATED: yes; Parameters: X5R, 10V, 10%; 03. Unit Price: 0.09; Tolerance: 10%; 3D-Export: No; Temperature Range: -55°C ~ 85°C; 01. Distributor: DigiKey; 02. Distributor Part Number: 1276-1173-6-ND; 09. Operating Temperature: -55°C ~ 85°C; 11. RoHS: YES; Type: X5R; Voltage Rating: 10V; ComponentLink4Description: Info; ComponentLink4URL: https://www.digikey.de/product-detail/en/samsung-electro-mechanics/CL05A474KP5NNNC/1276-1173-6-ND/3891687; ComponentLink5Description: DataSheet; ComponentLink5URL: https://media.digikey.com/pdf/Data%20Sheets/Samsung%20PDFs/CL_Series_MLCC_ds.pdf

## Nets that join several sheets
1V0: Power (C15.1 J1.2 J2.2), X7A15T-Power (16 pins), X7A15T-Decoupling (10 pins)
1V8: Power (C27.1 J4.2 J5.2), RelayDriver (C9.1 L1.1), X7A15T-Power (U7.F12 U7.H12 U7.K12 U7.M12), X7A15T-Decoupling (7 pins)
1V8A: RelayDriver (C10.1 L1.2), X7A15T-Power (U7.H10), X7A15T-Decoupling (C471.1)
3V3: Power (C53.1 J8.2 J9.2), RelayDriver (R128.1), X7A15T-Prog (15 pins), X7A15T-Fabric (9 pins), X7A15T-Power (26 pins), X7A15T-Decoupling (34 pins)
3V3IO: PCB-Relay-Board-V1 (J12.1 R121.2), Power (22 pins), X7A15T-Fabric (C56.2 U4.14)
12V0: PCB-Relay-Board-V1 (6 pins), Power (22 pins)
GND: PCB-Relay-Board-V1 (144 pins), Power (74 pins), RelayDriver (C9.2 C10.2 R129.1), X7A15T-Prog (26 pins), X7A15T-Fabric (14 pins), X7A15T-Power (49 pins), X7A15T-Decoupling (54 pins)
~{CS}: PCB-Relay-Board-V1 (R121.1 X4.B15), X7A15T-Fabric (5 pins)
A0: PCB-Relay-Board-V1 (X4.B18), X7A15T-Fabric (R120.2)
A1: PCB-Relay-Board-V1 (X4.A18), X7A15T-Fabric (R118.2)
A2: PCB-Relay-Board-V1 (X4.B17), X7A15T-Fabric (R119.2)
A3: PCB-Relay-Board-V1 (X4.A17), X7A15T-Fabric (R117.2)
DRV1: PCB-Relay-Board-V1 (Q1.1 R1.2), X7A15T-Fabric (U7.R2)
DRV2: PCB-Relay-Board-V1 (Q2.1 R2.2), X7A15T-Fabric (U7.R1)
DRV3: PCB-Relay-Board-V1 (Q3.1 R3.2), X7A15T-Fabric (U7.U14)
DRV4: PCB-Relay-Board-V1 (Q4.1 R4.2), X7A15T-Fabric (U7.U18)
DRV5: PCB-Relay-Board-V1 (Q5.1 R5.2), X7A15T-Fabric (U7.P2)
DRV6: PCB-Relay-Board-V1 (Q6.1 R6.2), X7A15T-Fabric (U7.N1)
DRV7: PCB-Relay-Board-V1 (Q7.1 R7.2), X7A15T-Fabric (U7.U12)
DRV8: PCB-Relay-Board-V1 (Q8.1 R8.2), X7A15T-Fabric (U7.V14)
DRV9: PCB-Relay-Board-V1 (Q9.1 R9.2), X7A15T-Fabric (U7.N2)
DRV10: PCB-Relay-Board-V1 (Q10.1 R10.2), X7A15T-Fabric (U7.M1)
DRV11: PCB-Relay-Board-V1 (Q11.1 R11.2), X7A15T-Fabric (U7.U11)
DRV12: PCB-Relay-Board-V1 (Q12.1 R12.2), X7A15T-Fabric (U7.V12)
DRV13: PCB-Relay-Board-V1 (Q13.1 R13.2), X7A15T-Fabric (U7.L1)
DRV14: PCB-Relay-Board-V1 (Q14.1 R14.2), X7A15T-Fabric (U7.K2)
DRV15: PCB-Relay-Board-V1 (Q15.1 R15.2), X7A15T-Fabric (U7.V10)
DRV16: PCB-Relay-Board-V1 (Q16.1 R16.2), X7A15T-Fabric (U7.V11)
DRV17: PCB-Relay-Board-V1 (Q17.1 R17.2), X7A15T-Fabric (U7.K1)
DRV18: PCB-Relay-Board-V1 (Q18.1 R18.2), X7A15T-Fabric (U7.J2)
DRV19: PCB-Relay-Board-V1 (Q19.1 R19.2), X7A15T-Fabric (U7.V9)
DRV20: PCB-Relay-Board-V1 (Q20.1 R20.2), X7A15T-Fabric (U7.U9)
DRV21: PCB-Relay-Board-V1 (Q21.1 R21.2), X7A15T-Fabric (U7.H1)
DRV22: PCB-Relay-Board-V1 (Q22.1 R22.2), X7A15T-Fabric (U7.H2)
DRV23: PCB-Relay-Board-V1 (Q23.1 R23.2), X7A15T-Fabric (U7.V7)
DRV24: PCB-Relay-Board-V1 (Q24.1 R24.2), X7A15T-Fabric (U7.U8)
DRV25: PCB-Relay-Board-V1 (Q25.1 R25.2), X7A15T-Fabric (U7.G1)
DRV26: PCB-Relay-Board-V1 (Q26.1 R26.2), X7A15T-Fabric (U7.G2)
DRV27: PCB-Relay-Board-V1 (Q27.1 R27.2), X7A15T-Fabric (U7.V6)
DRV28: PCB-Relay-Board-V1 (Q28.1 R28.2), X7A15T-Fabric (U7.U7)
DRV29: PCB-Relay-Board-V1 (Q29.1 R29.2), X7A15T-Fabric (U7.F1)
DRV30: PCB-Relay-Board-V1 (Q30.1 R30.2), X7A15T-Fabric (U7.E1)
DRV31: PCB-Relay-Board-V1 (Q31.1 R31.2), X7A15T-Fabric (U7.V5)
DRV32: PCB-Relay-Board-V1 (Q32.1 R32.2), X7A15T-Fabric (U7.U6)
DRV33: PCB-Relay-Board-V1 (Q33.1 R33.2), X7A15T-Fabric (U7.E2)
DRV34: PCB-Relay-Board-V1 (Q34.1 R34.2), X7A15T-Fabric (U7.C1)
DRV35: PCB-Relay-Board-V1 (Q35.1 R35.2), X7A15T-Fabric (U7.M2)
DRV36: PCB-Relay-Board-V1 (Q36.1 R36.2), X7A15T-Fabric (U7.V4)
DRV37: PCB-Relay-Board-V1 (Q37.1 R37.2), X7A15T-Fabric (U7.C2)
DRV38: PCB-Relay-Board-V1 (Q38.1 R38.2), X7A15T-Fabric (U7.B1)
DRV39: PCB-Relay-Board-V1 (Q39.1 R39.2), X7A15T-Fabric (U7.K3)
DRV40: PCB-Relay-Board-V1 (Q40.1 R40.2), X7A15T-Fabric (U7.P3)
DRV41: PCB-Relay-Board-V1 (Q41.1 R41.2), X7A15T-Fabric (U7.B2)
DRV42: PCB-Relay-Board-V1 (Q42.1 R42.2), X7A15T-Fabric (U7.A1)
DRV43: PCB-Relay-Board-V1 (Q43.1 R48.2), X7A15T-Fabric (U7.E3)
DRV44: PCB-Relay-Board-V1 (Q44.1 R49.2), X7A15T-Fabric (U7.V2)
DRV45: PCB-Relay-Board-V1 (Q45.1 R50.2), X7A15T-Fabric (U7.B7)
DRV46: PCB-Relay-Board-V1 (Q46.1 R51.2), X7A15T-Fabric (U7.A5)
DRV47: PCB-Relay-Board-V1 (Q47.1 R52.2), X7A15T-Fabric (U7.D2)
DRV48: PCB-Relay-Board-V1 (Q48.1 R53.2), X7A15T-Fabric (U7.U2)
DRV49: PCB-Relay-Board-V1 (Q49.1 R54.2), X7A15T-Fabric (U7.B8)
DRV50: PCB-Relay-Board-V1 (Q50.1 R55.2), X7A15T-Fabric (U7.B6)
DRV51: PCB-Relay-Board-V1 (Q51.1 R56.2), X7A15T-Fabric (U7.A6)
DRV52: PCB-Relay-Board-V1 (Q52.1 R57.2), X7A15T-Fabric (U7.V1)
DRV53: PCB-Relay-Board-V1 (Q53.1 R58.2), X7A15T-Fabric (U7.A10)
DRV54: PCB-Relay-Board-V1 (Q54.1 R59.2), X7A15T-Fabric (U7.A9)
DRV55: PCB-Relay-Board-V1 (Q55.1 R60.2), X7A15T-Fabric (U7.A8)
DRV56: PCB-Relay-Board-V1 (Q56.1 R61.2), X7A15T-Fabric (U7.U1)
DRV57: PCB-Relay-Board-V1 (Q57.1 R62.2), X7A15T-Fabric (U7.A4)
DRV58: PCB-Relay-Board-V1 (Q58.1 R63.2), X7A15T-Fabric (U7.B9)
DRV59: PCB-Relay-Board-V1 (Q59.1 R64.2), X7A15T-Fabric (U7.C4)
DRV60: PCB-Relay-Board-V1 (Q60.1 R65.2), X7A15T-Fabric (U7.T1)
DRV61: PCB-Relay-Board-V1 (Q61.1 R66.2), X7A15T-Fabric (U7.B4)
DRV62: PCB-Relay-Board-V1 (Q62.1 R67.2), X7A15T-Fabric (U7.A3)
DRV63: PCB-Relay-Board-V1 (Q63.1 R68.2), X7A15T-Fabric (U7.B3)
DRV64: PCB-Relay-Board-V1 (Q64.1 R69.2), X7A15T-Fabric (U7.U3)
FUN: RelayDriver (R129.2), X7A15T-Fabric (R127.1)
MISO: PCB-Relay-Board-V1 (X4.A15), X7A15T-Fabric (R102.1)
MOSI: PCB-Relay-Board-V1 (X4.A14), X7A15T-Fabric (U4.9)
NetJ11_5: PCB-Relay-Board-V1 (J11.5), Power (R77.1 U2.17)
NetJ11_7: PCB-Relay-Board-V1 (J11.7), Power (R78.1 U2.18)
NetJ11_9: PCB-Relay-Board-V1 (J11.9), Power (R79.1 U2.19)
nRST: RelayDriver (R128.2), X7A15T-Fabric (U7.M17)
SCLK: PCB-Relay-Board-V1 (X4.B14), X7A15T-Fabric (U4.5)